# EAGLE design v2 (EAGLE 7.5.0)
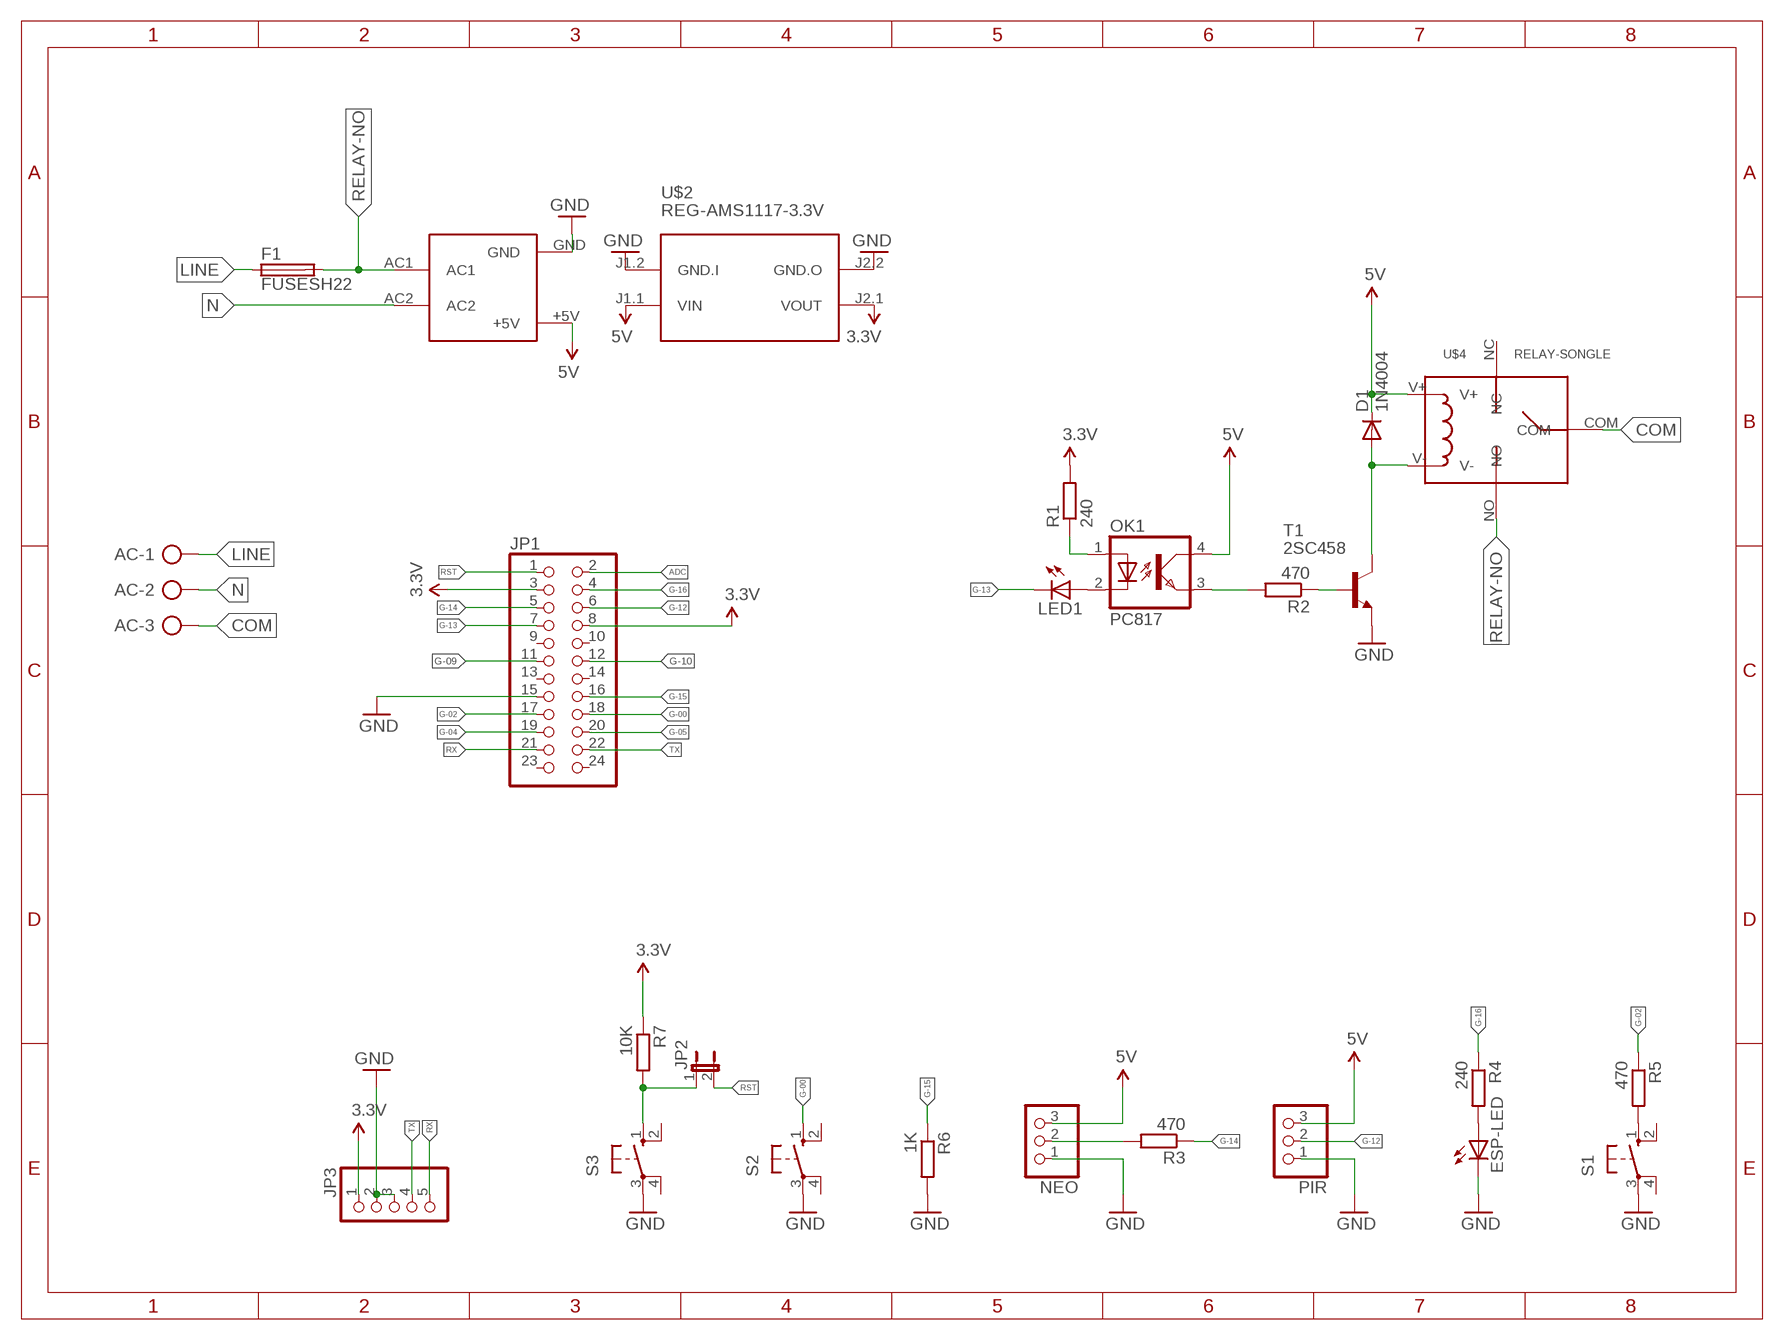
[diagram p0: schematic, sheet 1]

## Parts
AC  AK300/3  [AK300/3]
D1  1N4004  [DO41-10]
ESP-LED  LED5MM  [LED5MM]
F1  FUSESH22  [SH22]
JP1  PINHD-2X12  [2X12]
JP2  JUMPER-2PTH  [1X02]
JP3  PINHD-1X5  [1X05]
LED1  LED5MM  [LED5MM]
NEO  PINHD-1X3  [1X03]
OK1  PC817  [DIL04]
PIR  PINHD-1X3  [1X03]
R1  240  R-EU_0204/5  [0204/5]
R2  470  R-EU_0204/5  [0204/5]
R3  470  R-EU_0204/5  [0204/5]
R4  240  R-EU_0204/5  [0204/5]
R5  470  R-EU_0204/5  [0204/5]
R6  1K  R-EU_0204/5  [0204/5]
R7  10K  R-EU_0204/5  [0204/5]
S1  10-XX  [B3F-10XX]
S2  10-XX  [B3F-10XX]
S3  10-XX  [B3F-10XX]
T1  2SC458  [TO92-ECB]
U$1  HLK-PM01  [HLK-PM01]
U$2  REG-AMS1117-3.3V  [REG-AMS1117]
U$4  RELAY-SONGLE  [RELAY-SONGLE]

## Nets
3.3V: JP1.3 JP1.8 JP3.1 R1.2 R7.1 U$2.J2.1(VOUT)
5V: D1.C NEO.3 OK1.4(COL) PIR.3 U$1.+5V U$2.J1.1(VIN) U$4.V+
ADC: JP1.2
COM: AC.3 U$4.COM
G-00: JP1.18 S2.1(S)
G-02: JP1.17 R5.1
G-04: JP1.19
G-05: JP1.20
G-09: JP1.11
G-10: JP1.12
G-12: JP1.6 PIR.2
G-13: JP1.7 LED1.K(C)
G-14: JP1.5 R3.1
G-15: JP1.16 R6.1
G-16: JP1.4 R4.1
GND: ESP-LED.K(C) JP1.15 JP3.2 JP3.3 NEO.1 PIR.1 R6.2 S1.3(P) S2.3(P) S3.3(P) T1.E U$1.GND U$2.J1.2(GND.I) U$2.J2.2(GND.O)
LINE: AC.1 F1.1
N: AC.2 U$1.AC2
N$1: LED1.A OK1.2(C)
N$2: OK1.1(A) R1.1
N$3: OK1.3(EMIT) R2.2
N$4: R2.1 T1.B
N$5: D1.A T1.C U$4.V-
N$6: NEO.2 R3.2
N$7: R5.2 S1.1(S)
N$8: ESP-LED.A R4.2
N$9: JP2.1 R7.2 S3.1(S)
RELAY-NO: F1.2 U$1.AC1 U$4.NO
RST: JP1.1 JP2.2
RX: JP1.21 JP3.5
TX: JP1.22 JP3.4
Unconnected: JP1.9 JP1.10 JP1.13 JP1.14 JP1.23 JP1.24 S1.2(S1) S1.4(P1) S2.2(S1) S2.4(P1) S3.2(S1) S3.4(P1) U$4.NC

## Library data of the parts
AC = con-ptr500:AK300/3: CONNECTOR; OC_FARNELL: unknown; OC_NEWARK: unknown
D1 = diode:1N4004: DIODE general purpose rectifier, 1 A
ESP-LED LED1 = led:LED: LED OSRAM: - CHIPLED LG R971, LG N971, LY N971, LG Q971, LY Q971, LO R971, LY R971 LH N974, LH R974 LS Q976, LO Q976, LY Q976 LO Q996 - Hyper CHIPLED LW Q18S LB Q993, LB Q99A, LB R99A - SideLED LS A670, LO A670, LY A670, LG A670, LP A670 LB A673, LV A673, LT A673, LW A673 LH A674 LY A675 LS A676, LA A676, LO A676, LY A676, LW A676 LS A679, LY A679, LG A679 - Hyper Micro SIDELED® LS Y876, LA Y876, LO Y876, LY Y876 LT Y87S - SmartLED LW L88C, LW L88S LB L89C, LB L89S, LG L890 LS L89K, LO L89K, LY L89K LS L896, LA L896, LO L896, LY L896 - TOPLED LS T670, LO T670, LY T670, LG T670, LP T670 LSG T670, LSP T670, LSY T670, LOP T670, LYG T670 LG T671, LOG T671, LSG T671 LB T673, LV T673, LT T673, LW T673 LH T674 LS T676, LA T676, LO T676, LY T676, LB T676, LH T676, LSB T676, LW T676 LB T67C, LV T67C, LT T67C, LS T67K, LO T67K, LY T67K, LW E67C LS E67B, LA E67B, LO E67B, LY E67B, LB E67C, LV E67C, LT E67C LW T67C LS T679, LY T679, LG T679 LS T770, LO T770, LY T770, LG T770, LP T770 LB T773, LV T773, LT T773, LW T773 LH T774 LS E675, LA E675, LY E675, LS T675 LS T776, LA T776, LO T776, LY T776, LB T776 LHGB T686 LT T68C, LB T68C - Hyper Mini TOPLED® LB M676 - Mini TOPLED Santana® LG M470 LS M47K, LO M47K, LY M47K Source: http://www.osram.convergy.de LUXEON: - LUMILED® LXK2-PW12-R00, LXK2-PW12-S00, LXK2-PW14-U00, LXK2-PW14-V00 LXK2-PM12-R00, LXK2-PM12-S00, LXK2-PM14-U00 LXK2-PE12-Q00, LXK2-PE12-R00, LXK2-PE12-S00, LXK2-PE14-T00, LXK2-PE14-U00 LXK2-PB12-K00, LXK2-PB12-L00, LXK2-PB12-M00, LXK2-PB14-N00, LXK2-PB14-P00, LXK2-PB14-Q00 LXK2-PR12-L00, LXK2-PR12-M00, LXK2-PR14-Q00, LXK2-PR14-R00 LXK2-PD12-Q00, LXK2-PD12-R00, LXK2-PD12-S00 LXK2-PH12-R00, LXK2-PH12-S00 LXK2-PL12-P00, LXK2-PL12-Q00, LXK2-PL12-R00 Source: www.luxeon.com KINGBRIGHT: KA-3528ASYC Source: www.kingbright.com
F1 = fuse:FUSE: Fuse; OC_FARNELL: unknown; OC_NEWARK: unknown
JP1 = pinhead:PINHD-2X12: PIN HEADER
JP2 = SparkFun-Retired:JUMPER-2: Jumper Basic 0.1" spaced jumper. Use with breakaway headers.
JP3 = pinhead:PINHD-1X5: PIN HEADER
NEO PIR = pinhead:PINHD-1X3: PIN HEADER
OK1 = optocoupler:PC817: SHARP OPTO COUPLER; MPN: PC817X4J000F; OC_FARNELL: 9707727; OC_NEWARK: 97K7059
R1-R7 = rcl:R-EU_: RESISTOR, European symbol
S1-S3 = switch-omron:10-XX: OMRON SWITCH; MPN: B3F-1000; OC_FARNELL: 176432; OC_NEWARK: 36M3542
T1 = transistor:2SC458: NPN Silicon Epitaxial Planar Transistor Source: SEMTECH ELECTRONICS LTD. ... 2SC458 1.pdf
U$1 = HLK-PM01:HLK-PM01
U$2 = DIY-Modules:REG-AMS1117-*: Linear Regulator based on AMS1117 chip
U$4 = Seeed-OPL-Relay:RELAY-SONGLE

## Board
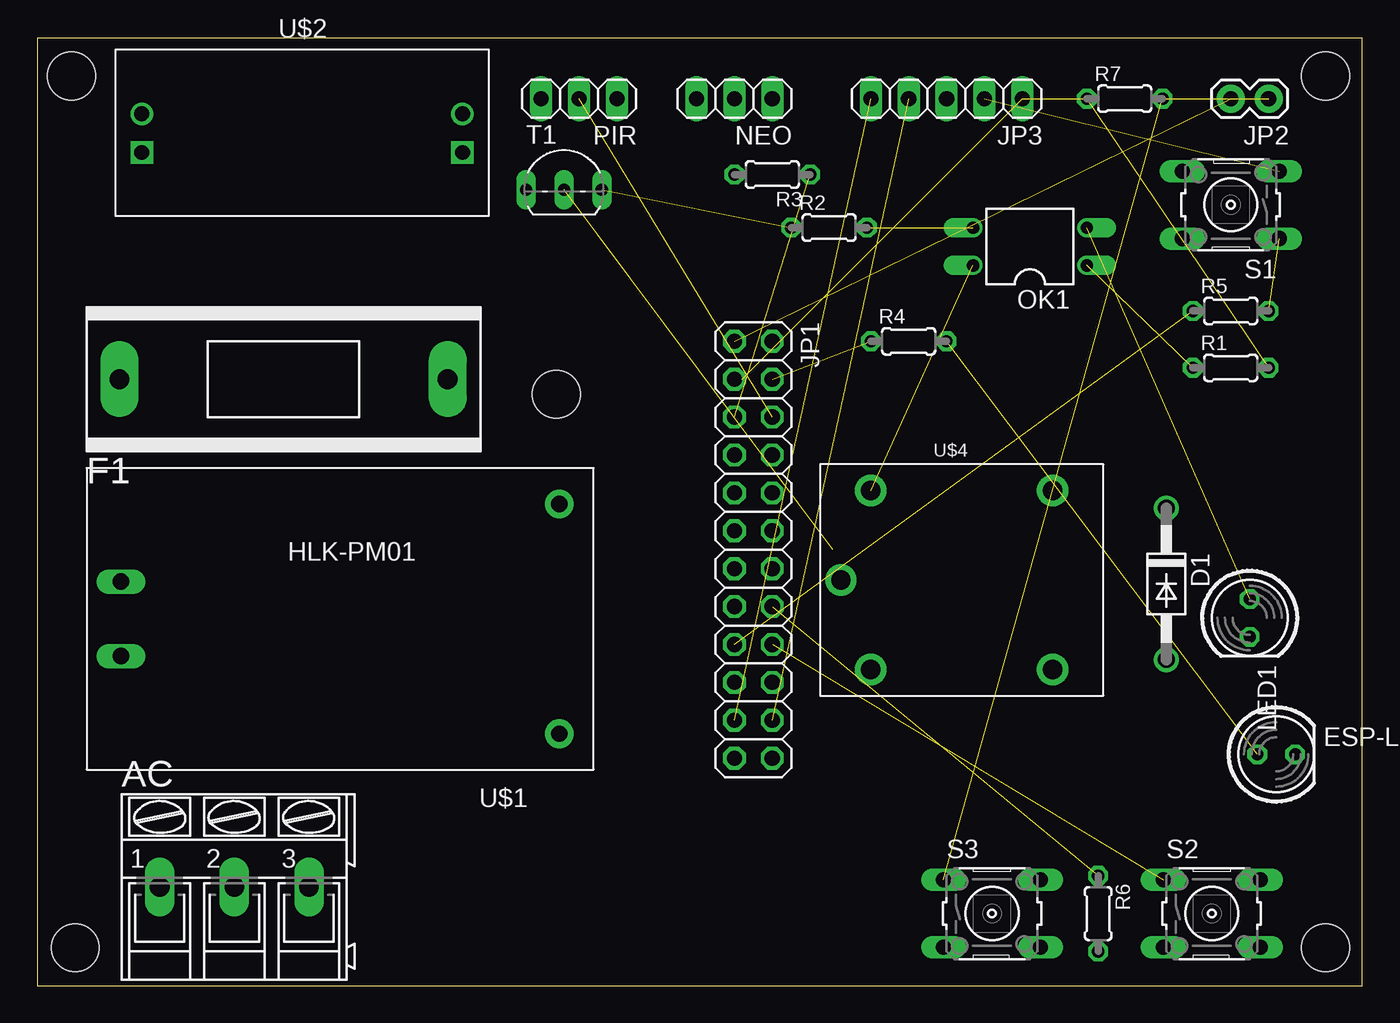
[diagram p1: board, top side]
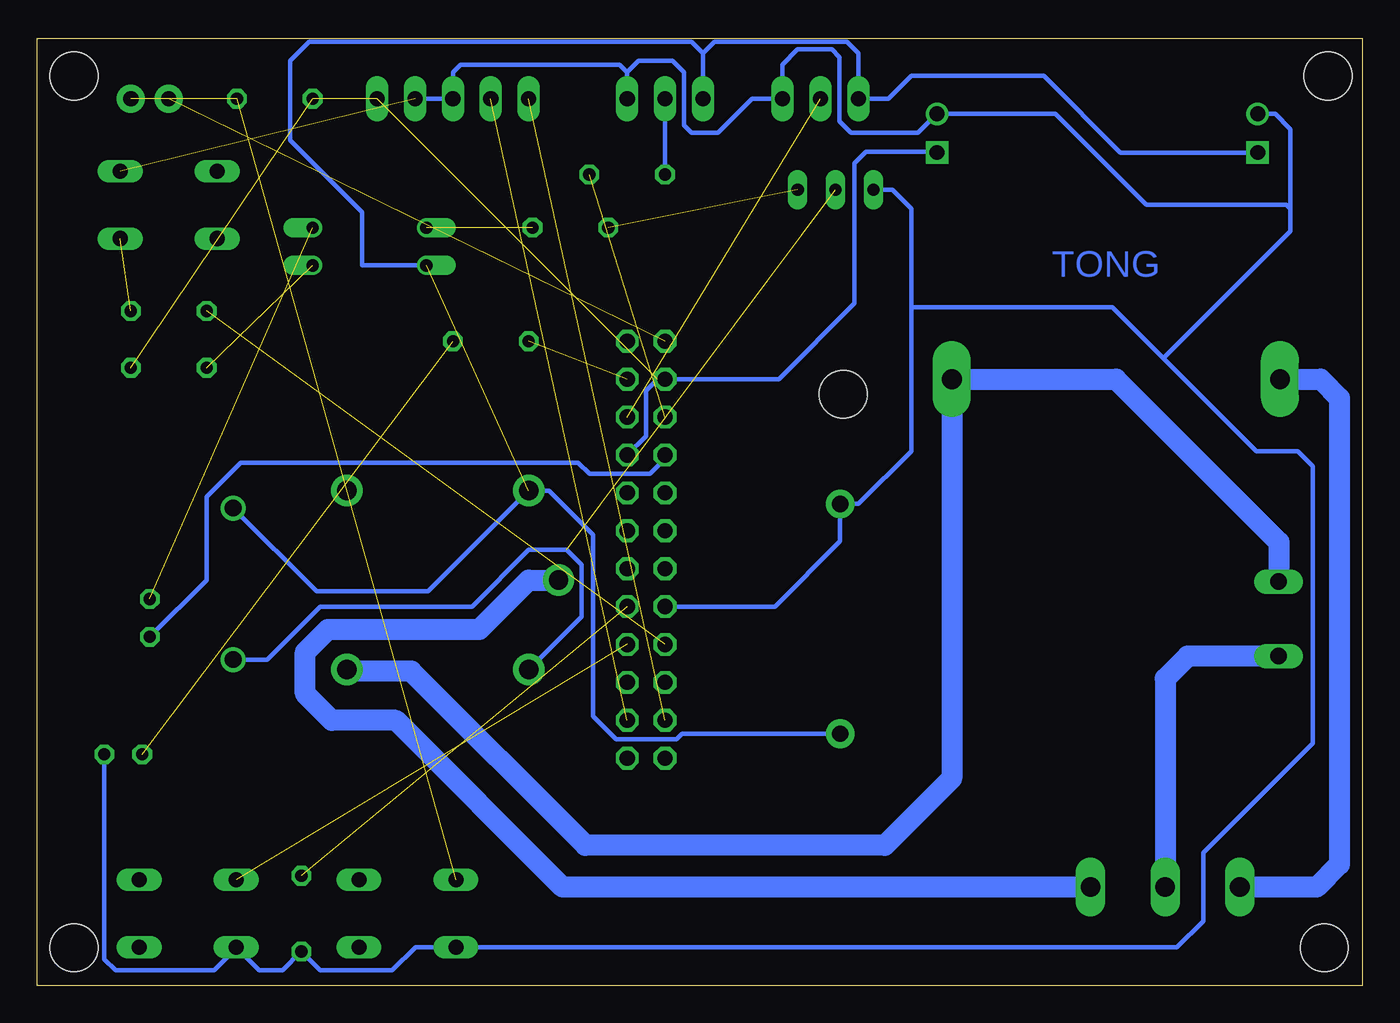
[diagram p2: board, bottom side, seen from below]

Size 88.82 x 63.49 mm. Coordinates in mm from the lower left corner, seen from the top.
Outline: 0,0 88.82,0 88.82,63.49 0,63.49 0,0
Copper layers (1*16): Top 0.035mm / dielectric 1.5mm / Bottom 0.035mm
Design rules "default": minimum track width 10mil, minimum drill 24mil, track to track 8mil, track to pad 8mil, pad to pad 8mil, via to via 8mil, smd to smd 8mil, copper to edge 40mil, drill to drill 8mil, minimum pad ring 10mil, minimum via ring 8mil, stop-mask expansion 4mil, vias tented up to drill 0mil, thermal gap 10mil
Holes 3.2 mm at 86.36,2.54 86.36,60.96 2.29,60.96 2.54,2.54 34.8,39.62

### Footprints (pad centres in the part's own frame; a part is rotated, then mirrored left to right if it is on the bottom)
AK300/3 = drill 1.321 long: 1 -5.004,0; 2 0,0; 3 5.004,0
DO41-10 = drill 1.118: A 5.08,0; C -5.08,0
LED5MM = drill 0.813 octagon: A -1.27,0; K 1.27,0
SH22 = drill 1.321 pad 2.54 long: 1 -10.998,0; 2 10.998,0
2X12 = drill 1.016 octagon: 1 -13.97,-1.27; 2 -13.97,1.27; 3 -11.43,-1.27; 4 -11.43,1.27; 5 -8.89,-1.27; 6 -8.89,1.27; 7 -6.35,-1.27; 8 -6.35,1.27; 9 -3.81,-1.27; 10 -3.81,1.27; 11 -1.27,-1.27; 12 -1.27,1.27; 13 1.27,-1.27; 14 1.27,1.27; 15 3.81,-1.27; 16 3.81,1.27; 17 6.35,-1.27; 18 6.35,1.27; 19 8.89,-1.27; 20 8.89,1.27; 21 11.43,-1.27; 22 11.43,1.27; 23 13.97,-1.27; 24 13.97,1.27
1X02 = drill 1.016 pad 1.88: 1 0,0; 2 2.54,0
1X05 = drill 1.016 long: 1 -5.08,0; 2 -2.54,0; 3 0,0; 4 2.54,0; 5 5.08,0
1X03 = drill 1.016 long: 1 -2.54,0; 2 0,0; 3 2.54,0
DIL04 = drill 0.813 offset: 1 -1.27,-3.81; 2 1.27,-3.81; 3 1.27,3.81; 4 -1.27,3.81
0204/5 = drill 0.813 octagon: 1 -2.54,0; 2 2.54,0
B3F-10XX = drill 1.016 long: 1 -3.251,2.261; 2 3.251,2.261; 3 -3.251,-2.261; 4 3.251,-2.261
TO92-ECB = drill 0.813 long: B 2.54,0; C 0,0; E -2.54,0
HLK-PM01 = drill 1.1 pad 1.93: +5V 15.19,-7.76; GND 15.19,7.64 | drill 1.1 long: AC1 -14.21,2.44; AC2 -14.21,-2.56
REG-AMS1117 = drill 1 square: J1.1 -10.77,-1.32; J2.1 10.72,-1.32 | drill 1: J1.2 -10.77,1.27; J2.2 10.72,1.27
RELAY-SONGLE = drill 1.3 pad 2.1: COM -8.1,0; NC 6.1,6; NO 6.1,-6; V+ -6.1,6; V- -6.1,-6

### Placement (x,y rotation side)
AC  13.21,6.6 0 top
D1  75.69,26.92 270 top
ESP-LED  83.06,15.49 0 top
F1  16.51,40.64 0 top
JP1  48.01,29.21 270 top
JP2  82.55,59.44 180 top
JP3  60.96,59.44 180 top
LED1  81.28,24.64 270 top
NEO  46.74,59.44 180 top
OK1  66.55,49.53 90 top
PIR  36.32,59.44 180 top
R1  80.01,41.4 0 top
R2  53.09,50.8 0 top
R3  49.28,54.36 180 top
R4  58.42,43.18 0 top
R5  80.01,45.21 0 top
R6  71.12,4.83 270 top
R7  72.9,59.44 0 top
S1  80.01,52.32 180 top
S2  78.74,4.83 0 top
S3  64.01,4.83 0 top
T1  35.31,53.34 0 top
U$1  19.81,24.64 0 top
U$2  17.78,57.15 0 top
U$4  61.98,27.18 0 top

### Tracks (layer width: path | path; a pad name or v marks a point on that pad's centre or on a via)
3.3V  (3 unrouted)
  Bottom 0.305: U$2.J2.1 28.55,55.88 33.27,55.88 34.04,55.12 34.04,45.72 39.12,40.64 JP1.3 47.24,40.64 48.01,39.88 48.01,36.83 JP1.8
5V  (1 unrouted)
  Bottom 0.305: U$1.+5V 45.61,16.88 45.97,16.51 50.04,16.51 51.56,18.03 51.56,30.23 54.51,33.18 U$4.V+ | U$4.V+ | U$4.V+ 62.64,26.42 70.1,26.42 D1.C | 44.2,62.48 43.43,63.25 34.54,63.25 33.78,62.48 PIR.3 31.75,59.44 30.23,60.96 21.34,60.96 16.21,55.83 U$2.J1.1 | NEO.3 44.2,62.48 | 44.2,62.48 44.96,63.25 70.61,63.25 71.88,61.98 71.88,56.64 67.06,51.82 67.06,48.26 OK1.4
COM
  Bottom 1.422: AC.3 53.59,6.6 64.77,17.78 69.09,17.78 70.87,19.56 70.87,22.35 69.34,23.88 59.18,23.88 55.88,27.18 U$4.COM
G-00  (1 unrouted)
G-02  (1 unrouted)
G-12  (1 unrouted)
G-13
  Bottom 0.305: LED1.K 77.47,27.18 77.47,32.77 75.18,35.05 52.58,35.05 51.82,34.29 47.75,34.29 46.74,35.31 JP1.7
G-14  (1 unrouted)
G-15  (1 unrouted)
G-16  (1 unrouted)
GND  (1 unrouted)
  Bottom 0.305: 30.23,45.47 30.23,35.81 33.76,32.28 U$1.GND 35,29.77 39.37,25.4 JP1.15 | 30.23,45.47 30.23,52.07 31.5,53.34 T1.E | 13.34,42.04 7.11,35.81 4.32,35.81 3.3,34.8 3.3,16.26 10.67,8.89 10.67,4.32 12.42,2.56 S3.3 63.48,2.56 65.02,1.02 69.85,1.02 R6.2 72.39,1.02 73.94,1.02 S2.3 75.49,2.49 76.96,1.02 83.57,1.02 84.33,1.78 ESP-LED.K | 13.34,42.04 16.76,45.47 30.23,45.47 | U$2.J1.2 5.84,58.42 4.83,57.4 4.83,52.07 | 4.83,52.07 4.83,50.55 13.34,42.04 | 49.28,61.21 48.51,61.98 46.23,61.98 45.47,61.21 45.47,57.66 44.96,57.15 43.18,57.15 40.89,59.44 PIR.1 38.86,61.72 37.85,62.74 35.56,62.74 35.05,62.23 35.05,57.91 34.29,57.15 29.77,57.15 U$2.J2.2 20.57,58.42 14.48,52.32 5.08,52.32 4.83,52.07 | 49.28,61.21 NEO.1 | JP3.2 JP3.3 60.96,61.21 60.45,61.72 49.78,61.72 49.28,61.21
LINE
  Bottom 1.422: F1.1 2.79,40.64 1.52,39.37 1.52,8.13 3.05,6.6 AC.1
N
  Bottom 1.422: U$1.AC2 11.7,22.08 13.21,20.57 AC.2
N$1  (1 unrouted)
N$2  (1 unrouted)
N$3  (1 unrouted)
N$4  (1 unrouted)
N$5  (1 unrouted)
  Bottom 0.305: D1.A 73.41,21.84 69.85,25.4 59.69,25.4 55.88,29.21 53.34,29.21 52.32,28.19 52.32,24.73 U$4.V-
N$6
  Bottom 0.305: NEO.2 R3.2
N$7  (1 unrouted)
N$8  (1 unrouted)
N$9  (2 unrouted)
RELAY-NO
  Bottom 1.422: U$1.AC1 5.59,27.09 5.59,29.72 16.51,40.64 F1.2 27.51,13.89 32,9.4 52.07,9.4 63.75,21.08 67.98,21.08 U$4.NO
RST  (1 unrouted)
RX  (1 unrouted)
TX  (1 unrouted)

### Text on the board
Bottom: TONG